# Altium schematic sheet CH572D-R0.SchDoc
size 250 x 220 mm
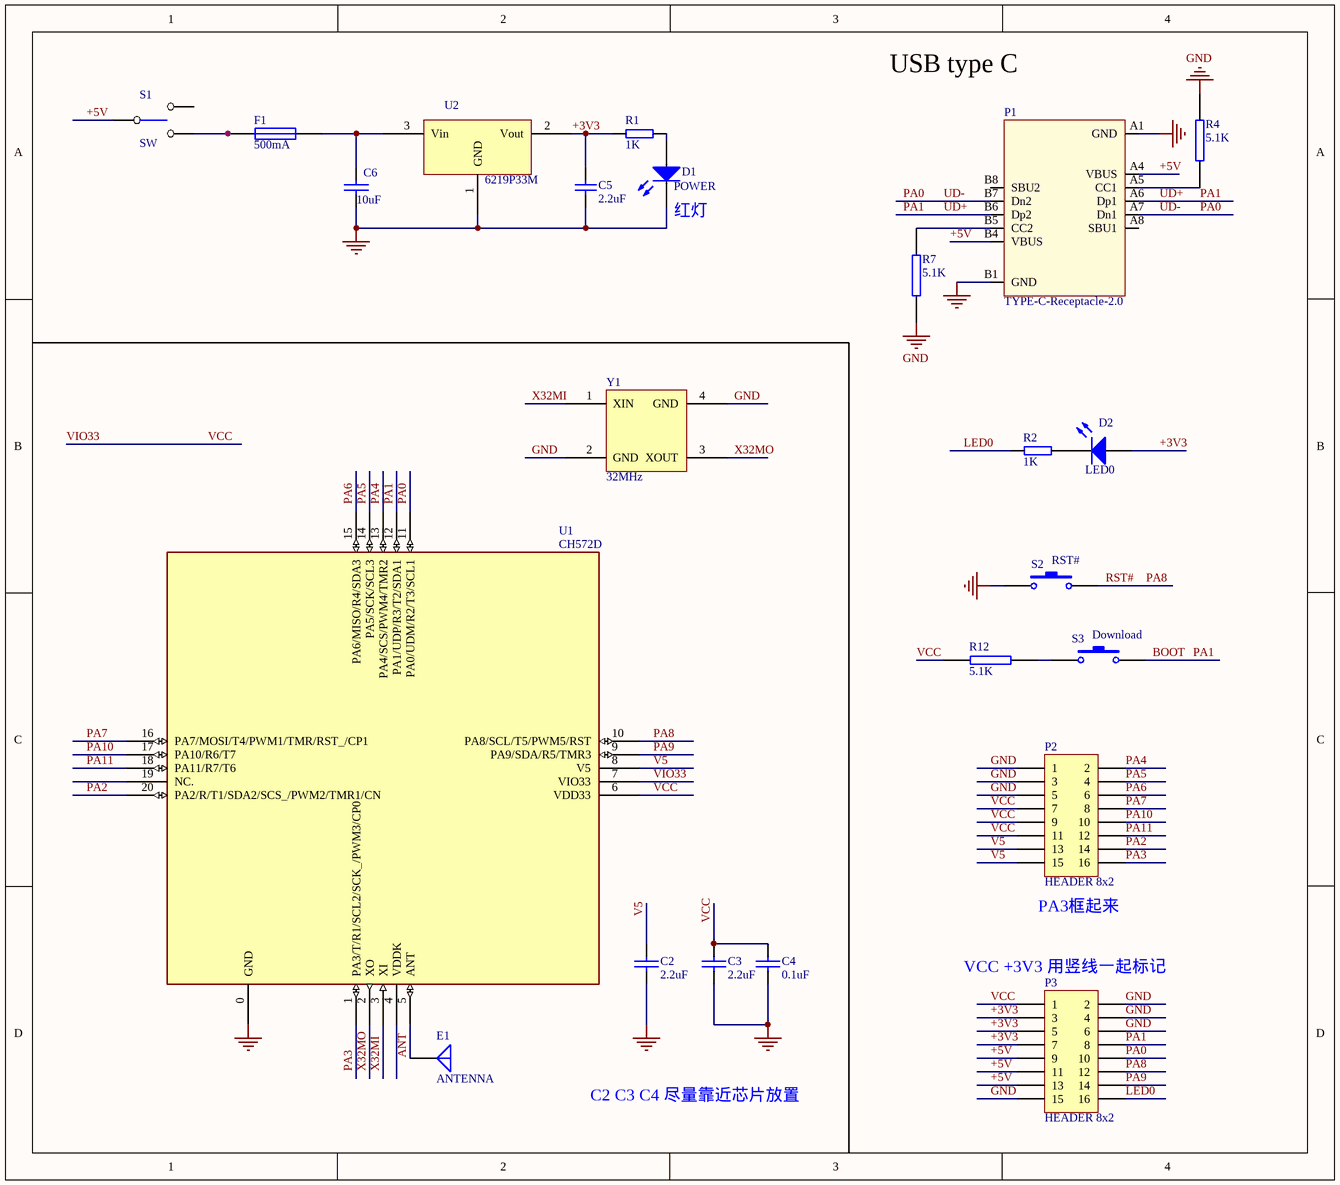
[diagram p0: CH572D-R0.SchDoc]

## Parts
C2  2.2uF  [0402_C]
C3  2.2uF  [0402_C]
C4  0.1uF  [0402_C]
C5  2.2uF  [0402_C]
C6  10uF  [0603_C]
D1  POWER  [0603+]
D2  LED0  [0603+]
E1  ANTENNA  [ANT-F-1-2.4G-1.6mmFR4]
F1  500mA  [0603]
P1  TYPE-C-Receptacle-2.0  [TYPE-C-Receptacle-2.0]
P2  HEADER 8x2  [IDC16-2.54mm]
P3  HEADER 8x2  [IDC16-2.54mm]
R1  1K  [0402]
R2  1K  [0402]
R4  5.1K  [0402]
R7  5.1K  [0402]
R12  5.1K  [0402]
S1  SW  [SW1]
S2  RST#  [SMD_6.1x3.65x2.5mm-KEY]
S3  Download  [SMD_6.1x3.65x2.5mm-KEY]
U1  CH572D  [QFN20_3X3]
U2  6219P33M  [SOT-23]
Y1  32MHz  [XT3225]

## Nets
GND: C2.2 C3.2 C4.2 C5.1 C6.2 D1.2(K) P1.A1(GND) P1.B1(GND) P2.1 P2.3 P2.5 P3.2 P3.4 P3.6 P3.15 R4.2 R7.1 S2.1 U1.0(GND) U2.1(GND) Y1.2(GND) Y1.4(GND)
+3V3: C5.2 D2.1(A) P3.3 P3.5 P3.7 R1.2 U2.2(Vout)
+5V: P1.A4(VBUS) P1.B4(VBUS) P3.9 P3.11 P3.13 S1.1
ANT: E1.1(A) U1.5(ANT)
BOOT: P1.A6(Dp1) P1.B6(Dp2) P3.8 S3.2 U1.12(PA1/UDP/R3/T2/SDA1)  [also labelled PA1, UD+]
LED0: P3.16 R2.1
PA0: P1.A7(Dn1) P1.B7(Dn2) P3.10 U1.11(PA0/UDM/R2/T3/SCL1)  [also labelled UD-]
PA2: P2.14 U1.20(PA2/R/T1/SDA2/SCS_/PWM2/TMR1/CN)
PA3: P2.16 U1.1(PA3/T/R1/SCL2/SCK_/PWM3/CP0)
PA4: P2.2 U1.13(PA4/SCS/PWM4/TMR2)
PA5: P2.4 U1.14(PA5/SCK/SCL3)
PA6: P2.6 U1.15(PA6/MISO/R4/SDA3)
PA7: P2.8 U1.16(PA7/MOSI/T4/PWM1/TMR/RST_/CP1)
PA8: P3.12 S2.2 U1.10(PA8/SCL/T5/PWM5/RST)  [also labelled RST#]
PA9: P3.14 U1.9(PA9/SDA/R5/TMR3)
PA10: P2.10 U1.17(PA10/R6/T7)
PA11: P2.12 U1.18(PA11/R7/T6)
V5: C2.1 P2.13 P2.15 U1.8(V5)
VCC: C3.1 C4.1 P2.7 P2.9 P2.11 P3.1 R12.2 U1.6(VDD33) U1.7(VIO33)  [also labelled VIO33]
X32MI: U1.3(XI) Y1.1(XIN)
X32MO: U1.2(XO) Y1.3(XOUT)
NetC6_1: C6.1 F1.2 U2.3(Vin)
NetD1_1: D1.1(A) R1.1
NetD2_2: D2.2(K) R2.2
NetF1_1: F1.1 S1.2
NetP1_A5: P1.A5(CC1) R4.1
NetP1_B5: P1.B5(CC2) R7.2
NetR12_1: R12.1 S3.1

Not connected (* = marked no-connect by the designer): P1 A8(SBU1) B8(SBU2); S1 3; U1 4(VDDK) 19(NC.)

## Notes on the sheet
- USB type C
- (near D1) 红灯
- (near P2) PA3框起来
- (near P3) VCC +3V3 用竖线一起标记
- C2 C3 C4 尽量靠近芯片放置

## Library data of the parts
C2-C4 C6 = CAP: Capacitor
C5 = Cap: Capacitor; Value: 100pF; Published: 8-Jun-2000; LatestRevisionDate: 17-Jul-2002; LatestRevisionNote: Re-released for DXP Platform.; PackageReference: RAD-0.3; Publisher: Altium Limited
D1 D2 = LED0: Typical INFRARED GaAs LED; Published: 8-Jun-2000; LatestRevisionDate: 08-Jul-2005; LatestRevisionNote: Mech Layer 1 removed.; PackageReference: LED-0; Publisher: Altium Limited
E1 = ANTENNA: Generic Antenna
F1 = FUSE1: Fuse
P1 = TYPE-C-Receptacle-2.0: Type-C USB2.0 母座
P2 P3 = HEADER 8x2: Header, 8-Pin, Dual row
R1 R2 = RES
R4 R7 R12 = RES2
S2 S3 = SW-PB: Switch; Published: 24-Mar-1999; LatestRevisionDate: 17-Jul-2002; LatestRevisionNote: Re-released for DXP Platform.; PackageReference: SPST-2; Publisher: Altium Limited; PackageDescription: Switch; 2 Leads
U1 = CH572D: RISC-V MCU with BLE/2.4GHz Wireless/USB/SPI/UART/I2C/PWM/CMP
Y1 = 晶体